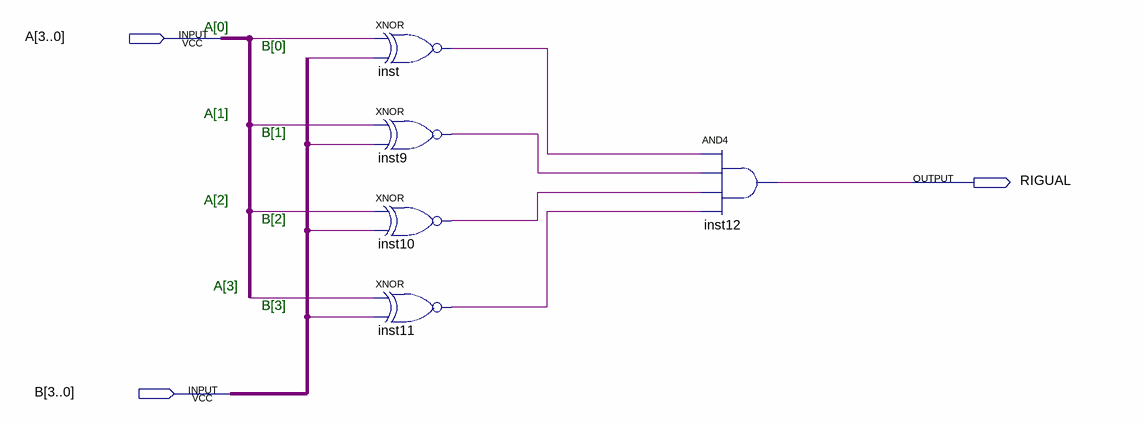
[diagram p0: schematic sheet]
// Quartus schematic Igual4Bits.bdf as structural Verilog: 5 symbols, 3 pins
module Igual4Bits (
  input  [3:0] A,
  input  [3:0] B,
  output RIGUAL
);

  wire inst9_out, inst10_out, inst11_out, inst_out;

  xnor inst (inst_out, A[0], B[0]);
  xnor inst9 (inst9_out, A[1], B[1]);
  xnor inst10 (inst10_out, A[2], B[2]);
  xnor inst11 (inst11_out, A[3], B[3]);
  and inst12 (RIGUAL, inst_out, inst9_out, inst10_out, inst11_out);

  // Notes on the sheet:
  //   A[0]
  //   B[0]
  //   A[1]
  //   B[1]
  //   A[2]
  //   B[2]
  //   A[3]
  //   B[3]
endmodule
